# Altium schematic sheet STM8L101F3_PINOUT.SchDoc
size C; SheetNumber: 19; SheetTotal: 19
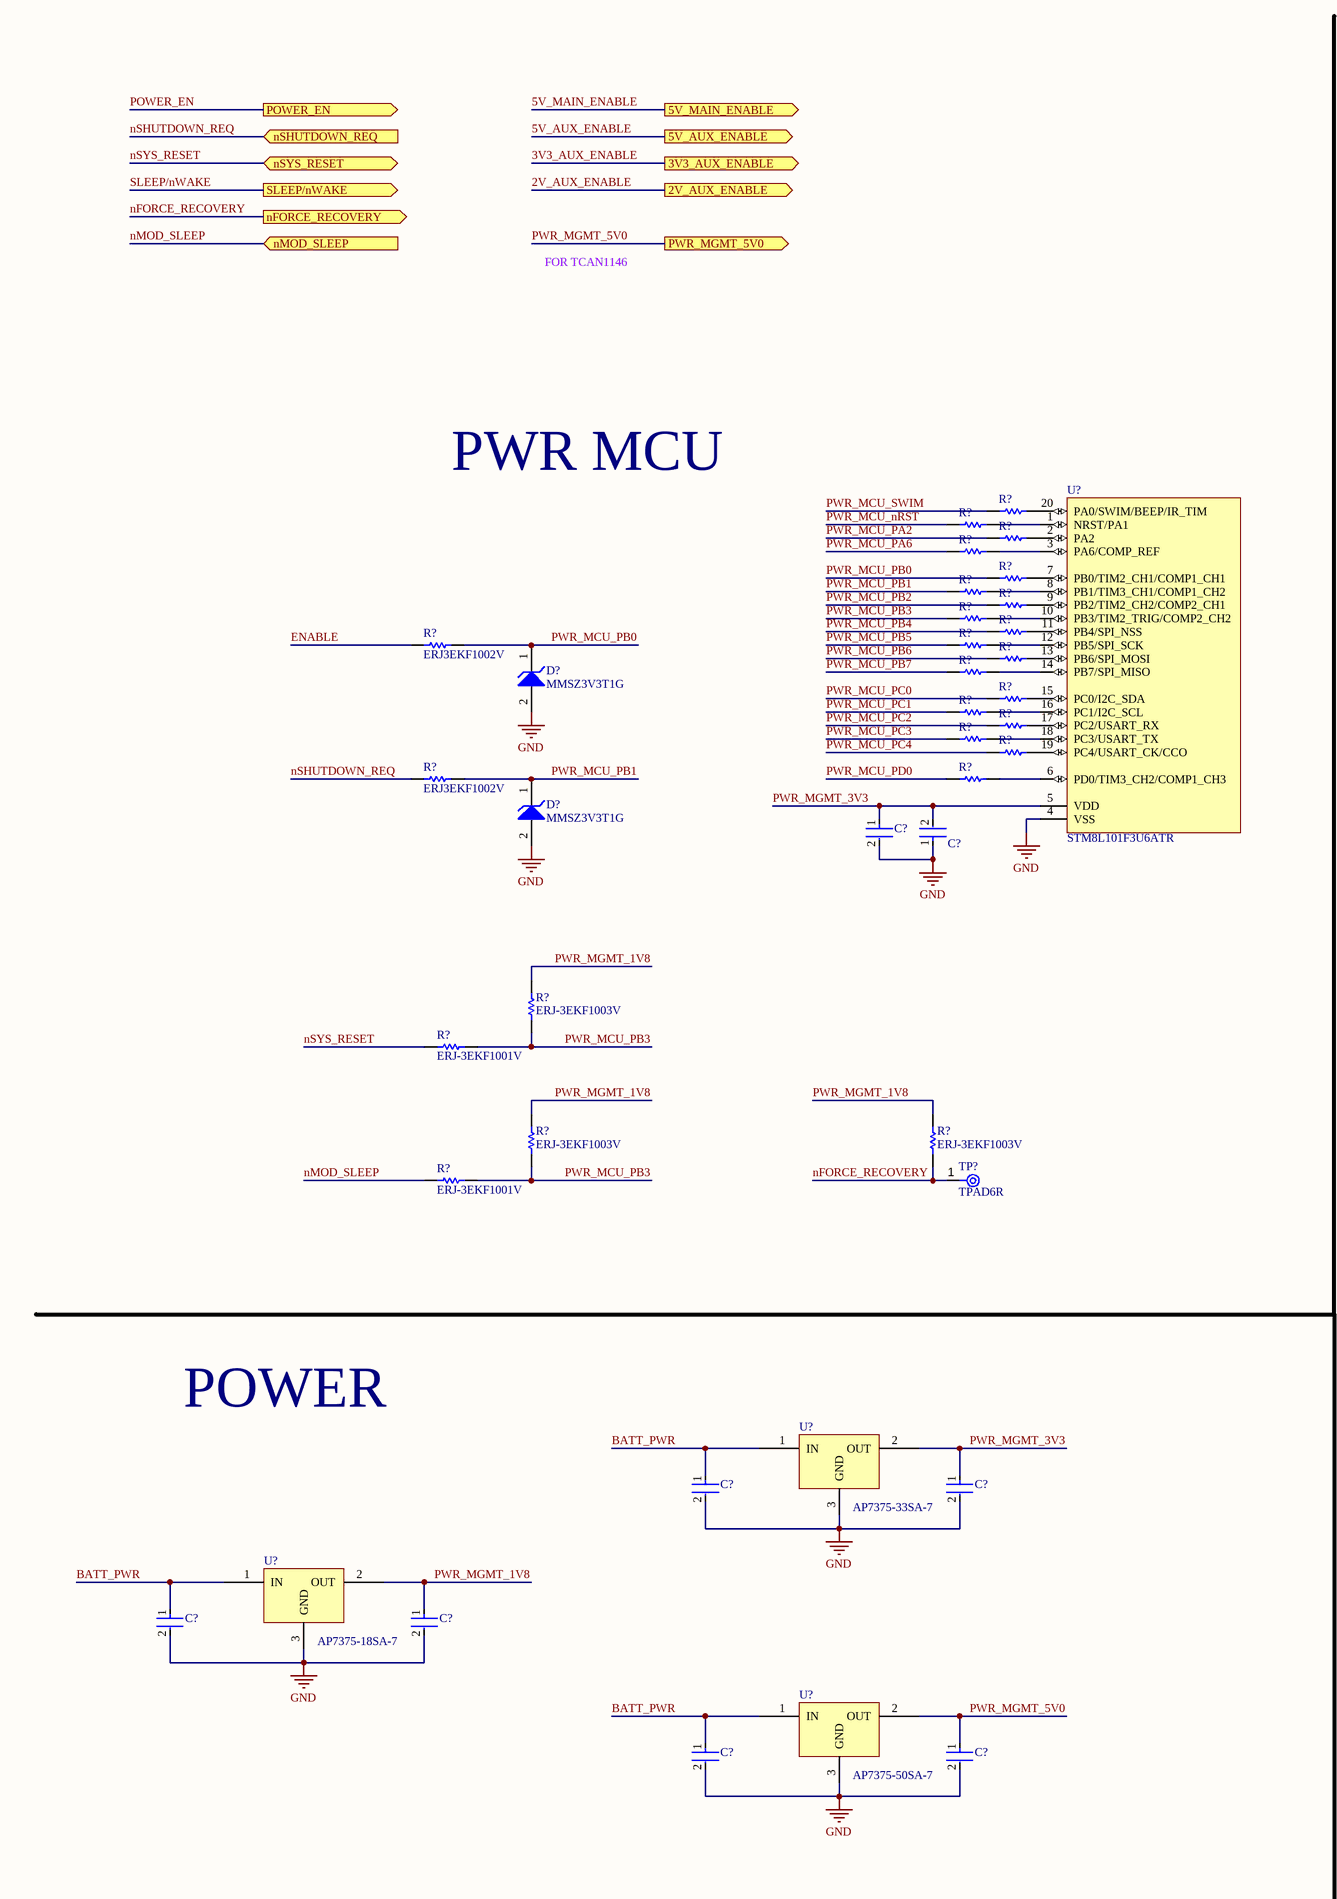
[diagram p0: STM8L101F3_PINOUT.SchDoc, left]
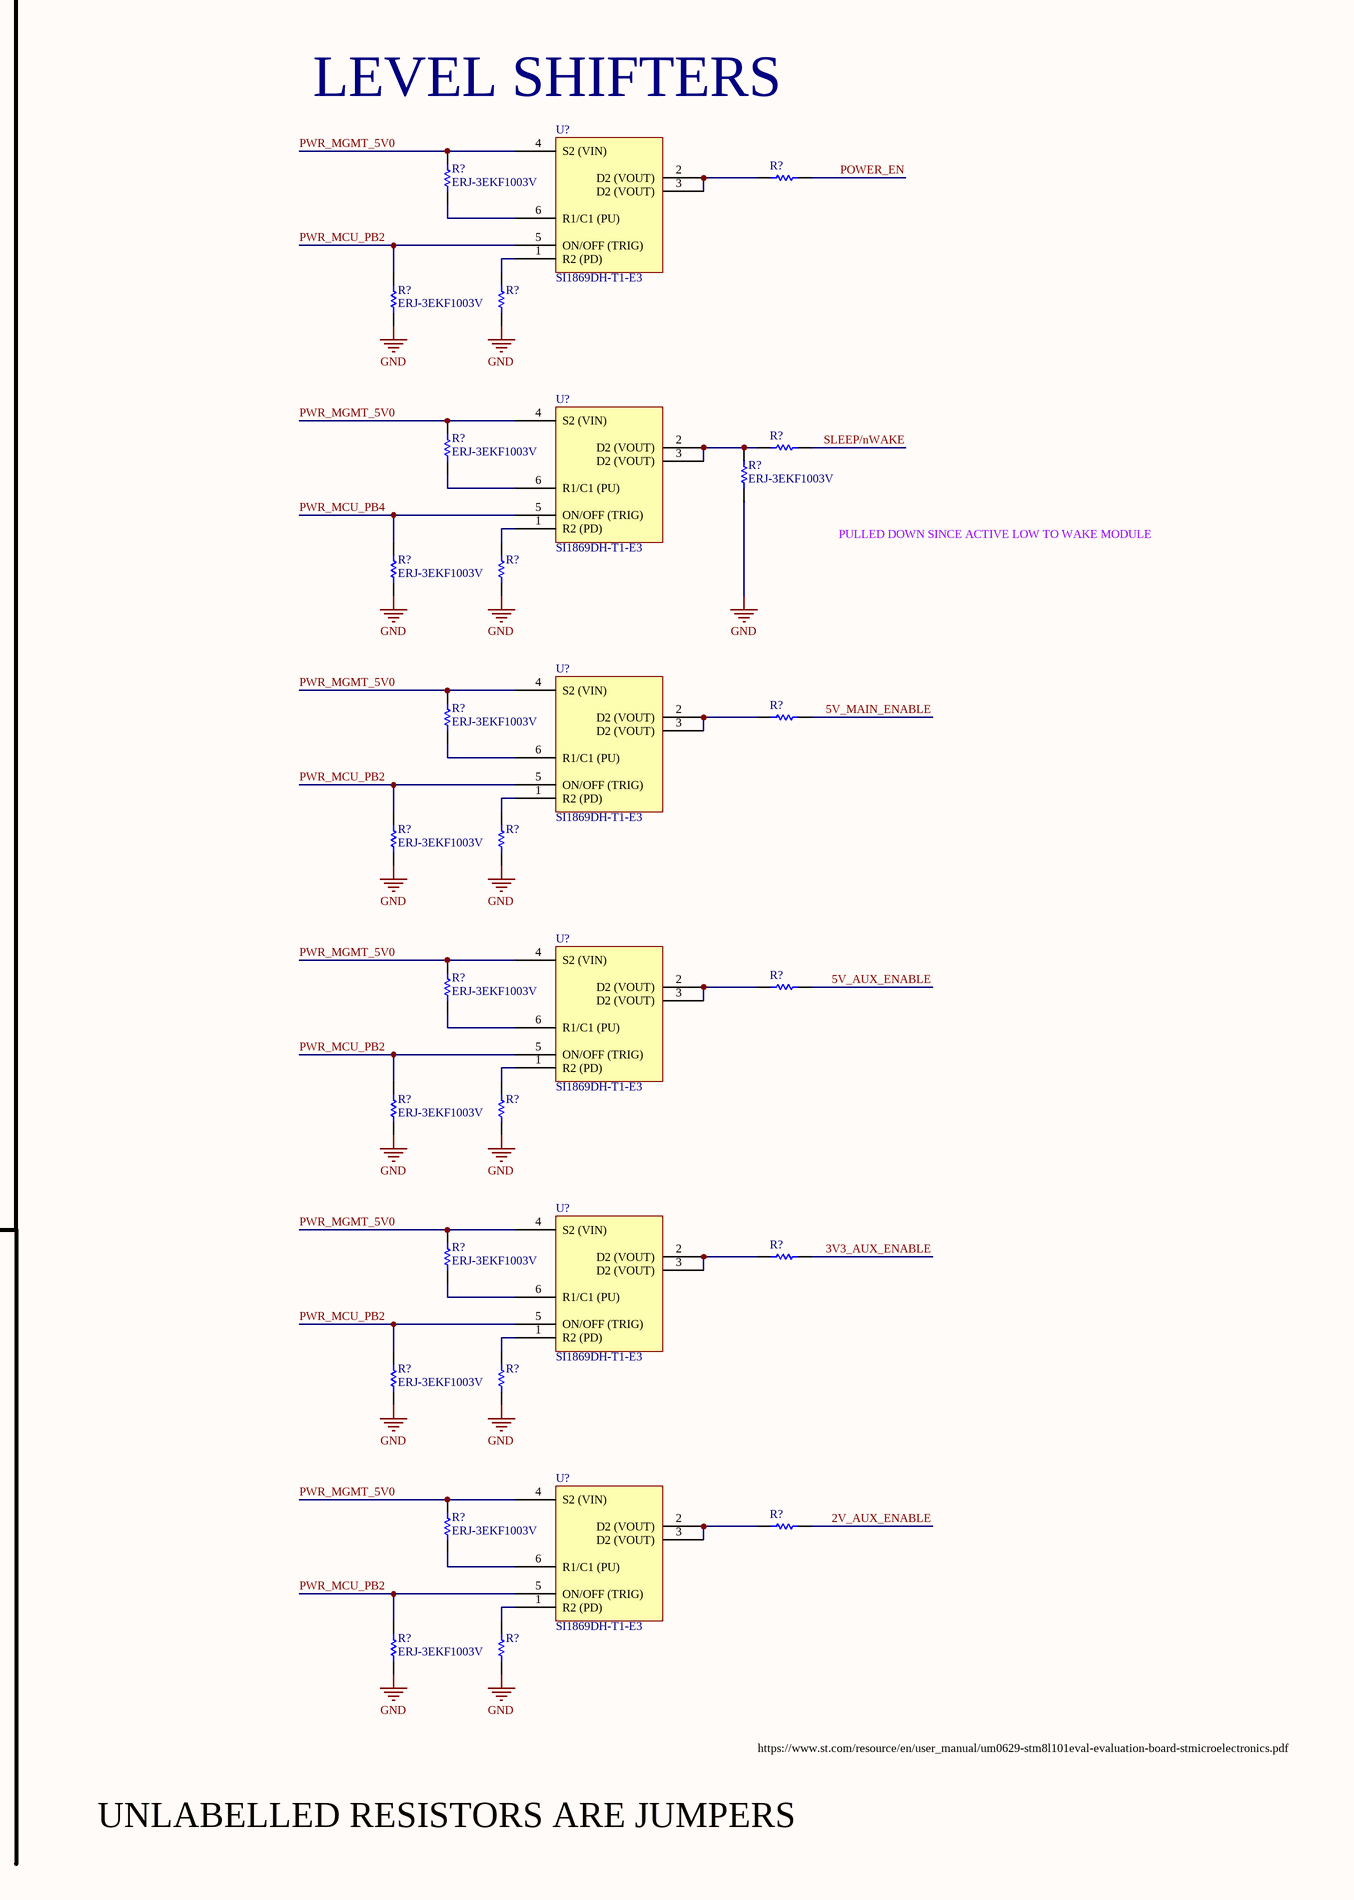
[diagram p1: STM8L101F3_PINOUT.SchDoc, right]

## Parts
(Parts that share a designator on the sheet are numbered #1, #2 ... from top to bottom, then left to right.)
C?#1  CL05A106MP5NUNC  [FP-CL05A106MP5NUNC-MFG]  (value not drawn)
C?#2  C1005X7R1H104K050BB  [FP-C1005-050-0_05-IPC_C]  (value not drawn)
C?#3  GRM188R61E106KA73D  [FP-GRM188-0_2-IPC_A]  (value not drawn)
C?#4  GRM188R61E106KA73D  [FP-GRM188-0_2-IPC_A]  (value not drawn)
C?#5  GRM188R61E106KA73D  [FP-GRM188-0_2-IPC_A]  (value not drawn)
C?#6  GRM188R61E106KA73D  [FP-GRM188-0_2-IPC_A]  (value not drawn)
C?#7  GRM188R61E106KA73D  [FP-GRM188-0_2-IPC_A]  (value not drawn)
C?#8  GRM188R61E106KA73D  [FP-GRM188-0_2-IPC_A]  (value not drawn)
D?#1  MMSZ3V3T1G  [ONSC-SOD-123-2-425-04_V]
D?#2  MMSZ3V3T1G  [ONSC-SOD-123-2-425-04_V]
R?#1  0402 JUMPER  [RESC1005X40X25ML05T05]  (value not drawn)
R?#2  ERJ-3EKF1003V  [RESC1608X55X30ML15T15]
R?#3  0402 JUMPER  [RESC1005X40X25ML05T05]  (value not drawn)
R?#4  ERJ-3EKF1003V  [RESC1608X55X30ML15T15]
R?#5  0402 JUMPER  [RESC1005X40X25ML05T05]  (value not drawn)
R?#6  0402 JUMPER  [RESC1005X40X25ML05T05]  (value not drawn)
R?#7  0402 JUMPER  [RESC1005X40X25ML05T05]  (value not drawn)
R?#8  0402 JUMPER  [RESC1005X40X25ML05T05]  (value not drawn)
R?#9  0402 JUMPER  [RESC1005X40X25ML05T05]  (value not drawn)
R?#10  ERJ-3EKF1003V  [RESC1608X55X30ML15T15]
R?#11  0402 JUMPER  [RESC1005X40X25ML05T05]  (value not drawn)
R?#12  0402 JUMPER  [RESC1005X40X25ML05T05]  (value not drawn)
R?#13  ERJ-3EKF1003V  [RESC1608X55X30ML15T15]
R?#14  0402 JUMPER  [RESC1005X40X25ML05T05]  (value not drawn)
R?#15  0402 JUMPER  [RESC1005X40X25ML05T05]  (value not drawn)
R?#16  0402 JUMPER  [RESC1005X40X25ML05T05]  (value not drawn)
R?#17  0402 JUMPER  [RESC1005X40X25ML05T05]  (value not drawn)
R?#18  ERJ3EKF1002V  [RESC1609X55X30LL15T15]
R?#19  0402 JUMPER  [RESC1005X40X25ML05T05]  (value not drawn)
R?#20  0402 JUMPER  [RESC1005X40X25ML05T05]  (value not drawn)
R?#21  0402 JUMPER  [RESC1005X40X25ML05T05]  (value not drawn)
R?#22  ERJ-3EKF1003V  [RESC1608X55X30ML15T15]
R?#23  0402 JUMPER  [RESC1005X40X25ML05T05]  (value not drawn)
R?#24  0402 JUMPER  [RESC1005X40X25ML05T05]  (value not drawn)
R?#25  0402 JUMPER  [RESC1005X40X25ML05T05]  (value not drawn)
R?#26  0402 JUMPER  [RESC1005X40X25ML05T05]  (value not drawn)
R?#27  0402 JUMPER  [RESC1005X40X25ML05T05]  (value not drawn)
R?#28  0402 JUMPER  [RESC1005X40X25ML05T05]  (value not drawn)
R?#29  ERJ3EKF1002V  [RESC1609X55X30LL15T15]
R?#30  0402 JUMPER  [RESC1005X40X25ML05T05]  (value not drawn)
R?#31  ERJ-3EKF1003V  [RESC1608X55X30ML15T15]
R?#32  0402 JUMPER  [RESC1005X40X25ML05T05]  (value not drawn)
R?#33  ERJ-3EKF1003V  [RESC1608X55X30ML15T15]
R?#34  ERJ-3EKF1003V  [RESC1608X55X30ML15T15]
R?#35  ERJ-3EKF1001V  [RESC1608X55X30LL15T15]
R?#36  0402 JUMPER  [RESC1005X40X25ML05T05]  (value not drawn)
R?#37  ERJ-3EKF1003V  [RESC1608X55X30ML15T15]
R?#38  ERJ-3EKF1003V  [RESC1608X55X30ML15T15]
R?#39  ERJ-3EKF1003V  [RESC1608X55X30ML15T15]
R?#40  ERJ-3EKF1001V  [RESC1608X55X30LL15T15]
R?#41  0402 JUMPER  [RESC1005X40X25ML05T05]  (value not drawn)
R?#42  ERJ-3EKF1003V  [RESC1608X55X30ML15T15]
R?#43  0402 JUMPER  [RESC1005X40X25ML05T05]  (value not drawn)
R?#44  ERJ-3EKF1003V  [RESC1608X55X30ML15T15]
R?#45  0402 JUMPER  [RESC1005X40X25ML05T05]  (value not drawn)
R?#46  ERJ-3EKF1003V  [RESC1608X55X30ML15T15]
R?#47  0402 JUMPER  [RESC1005X40X25ML05T05]  (value not drawn)
R?#48  ERJ-3EKF1003V  [RESC1608X55X30ML15T15]
R?#49  0402 JUMPER  [RESC1005X40X25ML05T05]  (value not drawn)
R?#50  ERJ-3EKF1003V  [RESC1608X55X30ML15T15]
TP?  TPAD6R  [New footprint 1]
U?#1  SI1869DH-T1-E3  [SOT65P242X110-6N]
U?#2  STM8L101F3U6ATR  [UFQFPN20_V]
U?#3  SI1869DH-T1-E3  [SOT65P242X110-6N]
U?#4  SI1869DH-T1-E3  [SOT65P242X110-6N]
U?#5  SI1869DH-T1-E3  [SOT65P242X110-6N]
U?#6  SI1869DH-T1-E3  [SOT65P242X110-6N]
U?#7  AP7375-33SA-7  [SOT90P285X110-3N]
U?#8  SI1869DH-T1-E3  [SOT65P242X110-6N]
U?#9  AP7375-18SA-7  [SOT90P285X110-3N]
U?#10  AP7375-50SA-7  [SOT90P285X110-3N]

## Ports
2V_AUX_ENABLE (out), 3V3_AUX_ENABLE (out), 5V_AUX_ENABLE (out), 5V_MAIN_ENABLE (out), nFORCE_RECOVERY (out), nMOD_SLEEP (in), nSHUTDOWN_REQ (in), nSYS_RESET (bidir), POWER_EN (out), PWR_MGMT_5V0 (out), SLEEP/nWAKE (out)

## Nets
GND: C?#1.2 C?#2.1 C?#3.2 C?#4.2 C?#5.2 C?#6.2 C?#7.2 C?#8.2 D?#1.2(A) D?#2.2(A) R?#3.2 R?#4.1 R?#13.1 R?#20.2 R?#22.1 R?#32.2 R?#33.1 R?#41.2 R?#42.1 R?#45.2 R?#46.1 R?#49.2 R?#50.1 U?#2.4(VSS) U?#7.3(GND) U?#9.3(GND) U?#10.3(GND)
2V_AUX_ENABLE: R?#47.2 ; port 2V_AUX_ENABLE
3V3_AUX_ENABLE: R?#43.2 ; port 3V3_AUX_ENABLE
5V_AUX_ENABLE: R?#36.2 ; port 5V_AUX_ENABLE
5V_MAIN_ENABLE: R?#30.2 ; port 5V_MAIN_ENABLE
BATT_PWR: C?#3.1 C?#5.1 C?#7.1 U?#7.1(IN) U?#9.1(IN) U?#10.1(IN)
ENABLE: R?#18.1
nFORCE_RECOVERY: R?#39.1 TP?.1(TP) ; port nFORCE_RECOVERY
nMOD_SLEEP: R?#40.1 ; port nMOD_SLEEP
nSHUTDOWN_REQ: R?#29.1 ; port nSHUTDOWN_REQ
nSYS_RESET: R?#35.1 ; port nSYS_RESET
POWER_EN: R?#1.2 ; port POWER_EN
PWR_MCU_nRST: R?#6.1
PWR_MCU_PA2: R?#7.1
PWR_MCU_PA6: R?#9.1
PWR_MCU_PB0: D?#1.1(K) R?#11.1 R?#18.2
PWR_MCU_PB1: D?#2.1(K) R?#12.1 R?#29.2
PWR_MCU_PB2: R?#4.2 R?#14.1 R?#33.2 R?#42.2 R?#46.2 R?#50.2 U?#1.5(ON/OFF_(TRIG)) U?#4.5(ON/OFF_(TRIG)) U?#5.5(ON/OFF_(TRIG)) U?#6.5(ON/OFF_(TRIG)) U?#8.5(ON/OFF_(TRIG))
PWR_MCU_PB3: R?#15.1 R?#34.1 R?#35.2 R?#38.1 R?#40.2
PWR_MCU_PB4: R?#16.1 R?#22.2 U?#3.5(ON/OFF_(TRIG))
PWR_MCU_PB5: R?#17.1
PWR_MCU_PB6: R?#19.1
PWR_MCU_PB7: R?#21.1
PWR_MCU_PC0: R?#23.1
PWR_MCU_PC1: R?#24.1
PWR_MCU_PC2: R?#25.1
PWR_MCU_PC3: R?#26.1
PWR_MCU_PC4: R?#27.1
PWR_MCU_PD0: R?#28.1
PWR_MCU_SWIM: R?#5.1
PWR_MGMT_1V8: C?#6.1 R?#34.2 R?#38.2 R?#39.2 U?#9.2(OUT)
PWR_MGMT_3V3: C?#1.1 C?#2.2 C?#4.1 U?#2.5(VDD) U?#7.2(OUT)
PWR_MGMT_5V0: C?#8.1 R?#2.2 R?#10.2 R?#31.2 R?#37.2 R?#44.2 R?#48.2 U?#1.4(S2_(VIN)) U?#3.4(S2_(VIN)) U?#4.4(S2_(VIN)) U?#5.4(S2_(VIN)) U?#6.4(S2_(VIN)) U?#8.4(S2_(VIN)) U?#10.2(OUT) ; port PWR_MGMT_5V0
SLEEP/nWAKE: R?#8.2 ; port SLEEP/nWAKE
NetR?#1_1: R?#1.1 U?#1.2(D2_(VOUT)) U?#1.3(D2_(VOUT))
NetR?#2_1: R?#2.1 U?#1.6(R1/C1_(PU))
NetR?#3_1: R?#3.1 U?#1.1(R2_(PD))
NetR?#5_2: R?#5.2 U?#2.20(PA0/SWIM/BEEP/IR_TIM)
NetR?#6_2: R?#6.2 U?#2.1(NRST/PA1)
NetR?#7_2: R?#7.2 U?#2.2(PA2)
NetR?#8_1: R?#8.1 R?#13.2 U?#3.2(D2_(VOUT)) U?#3.3(D2_(VOUT))
NetR?#9_2: R?#9.2 U?#2.3(PA6/COMP_REF)
NetR?#10_1: R?#10.1 U?#3.6(R1/C1_(PU))
NetR?#11_2: R?#11.2 U?#2.7(PB0/TIM2_CH1/COMP1_CH1)
NetR?#12_2: R?#12.2 U?#2.8(PB1/TIM3_CH1/COMP1_CH2)
NetR?#14_2: R?#14.2 U?#2.9(PB2/TIM2_CH2/COMP2_CH1)
NetR?#15_2: R?#15.2 U?#2.10(PB3/TIM2_TRIG/COMP2_CH2)
NetR?#16_2: R?#16.2 U?#2.11(PB4/SPI_NSS)
NetR?#17_2: R?#17.2 U?#2.12(PB5/SPI_SCK)
NetR?#19_2: R?#19.2 U?#2.13(PB6/SPI_MOSI)
NetR?#20_1: R?#20.1 U?#3.1(R2_(PD))
NetR?#21_2: R?#21.2 U?#2.14(PB7/SPI_MISO)
NetR?#23_2: R?#23.2 U?#2.15(PC0/I2C_SDA)
NetR?#24_2: R?#24.2 U?#2.16(PC1/I2C_SCL)
NetR?#25_2: R?#25.2 U?#2.17(PC2/USART_RX)
NetR?#26_2: R?#26.2 U?#2.18(PC3/USART_TX)
NetR?#27_2: R?#27.2 U?#2.19(PC4/USART_CK/CCO)
NetR?#28_2: R?#28.2 U?#2.6(PD0/TIM3_CH2/COMP1_CH3)
NetR?#30_1: R?#30.1 U?#4.2(D2_(VOUT)) U?#4.3(D2_(VOUT))
NetR?#31_1: R?#31.1 U?#4.6(R1/C1_(PU))
NetR?#32_1: R?#32.1 U?#4.1(R2_(PD))
NetR?#36_1: R?#36.1 U?#5.2(D2_(VOUT)) U?#5.3(D2_(VOUT))
NetR?#37_1: R?#37.1 U?#5.6(R1/C1_(PU))
NetR?#41_1: R?#41.1 U?#5.1(R2_(PD))
NetR?#43_1: R?#43.1 U?#6.2(D2_(VOUT)) U?#6.3(D2_(VOUT))
NetR?#44_1: R?#44.1 U?#6.6(R1/C1_(PU))
NetR?#45_1: R?#45.1 U?#6.1(R2_(PD))
NetR?#47_1: R?#47.1 U?#8.2(D2_(VOUT)) U?#8.3(D2_(VOUT))
NetR?#48_1: R?#48.1 U?#8.6(R1/C1_(PU))
NetR?#49_1: R?#49.1 U?#8.1(R2_(PD))

## Notes on the sheet
- LEVEL SHIFTERS
- FOR TCAN1146
- PWR MCU
- PULLED DOWN SINCE ACTIVE LOW TO WAKE MODULE
- POWER
- https://www.st.com/resource/en/user_manual/um0629-stm8l101eval-evaluation-board-stmicroelectronics.pdf
- UNLABELLED RESISTORS ARE JUMPERS

## Library data of the parts
C?#1 = CMP-13271-000002-1: CAP CER 10UF 10V X5R 0402; Manufacturer: Samsung; Temperature Coefficient: 15%; Tolerance: 20%; Material: Ceramic; Octopart: https://octopart.com/cl05a106mp5nunc-samsung-22457395; Voltage Rating: 10V; RoHS: TRUE; Value: 10uF; Height: 0.7mm; Digikey Description: CAP CER 10UF 10V X5R 0402; Automotive: No; Package: CL05A106MP5NUNC; Device Class L1: Passive Components; Capacitance: 10uF; Temperature Range High: +85°C; ComponentLink2Description: Datasheet; Device Class L2: Capacitors; Temperature Characteristic: X5R; Manufacturer Part Number: CL05A106MP5NUNC; Temperature: -55°C to +85°C; ComponentLink2URL: http://www.samsungsem.com/kr/support/product-search/mlcc/__icsFiles/afieldfile/2019/05/10/19-CL05A106MP5NUNC.pdf; Device Class L3: Ceramic Capacitors; Category: Cap; Temperature Range Low: -55°C; Ipc Land Pattern Name: CAPC10050X50; Lead Free: Yes
C?#2 = CMP-2000-05393-2: Multilayer Ceramic Capacitors 100nF ±10% 50V X7R SMD 0402; Voltage: 50V; Dielectric Material: Ceramic; Min Operating Temperature: -55°C; Depth: 0.5mm; Radiation Hardening: No; RoHS Compliant: Yes; Voltage Rating (DC): 50V; Lead Free: Lead Free; Resistor Type: Ceramic; Height: 0.5mm; Dielectric: X7R; Thickness: 0.022inch; Case/Package: 0402; Case Code (Metric): 1005; Termination: SMD/SMT; Capacitance: 100nF; Packaging: Tape and Reel; Max Operating Temperature: 125°C; Mount: Surface Mount; Package Quantity: 1; Width: 0.02inch; Weight: 2.3E-05oz; Voltage Rating: 50V; Tolerance: 10%; Construction: Flat; Case Code (Imperial): 0402; Length: 1mm; REACH SVHC: No SVHC; Series: C
C?#3-C?#8 = CMP-06035-045268-1: Chip Multilayer Ceramic Capacitors for General Purpose, 0603, 10uF, X5R, 15%, 10%, 25V; Case/Package: 0603
D?#1 D?#2 = CMP-1060-00515-1: Zener Voltage Regulator, 500 mW, 2-Pin SOD-123, Pb-Free, Tape and Reel; Manufacturer: On Semiconductor; P Max (W): 0.5; ComponentLink3URL: http://www.onsemi.com/pub_link/Collateral/425-04.PDF; ComponentLink2Description: Datasheet; DatasheetVersion: Rev. 11; ComponentLink1URL: http://www.onsemi.com/; PackageDescription: 2-Pin SOD, Body 1.6 x 2.69 mm; Mounting Technology: Surface Mount; ComponentLink3Description: Package Specification; ComponentLink1Description: Manufacturer URL; Packing: Tape and Reel; ComponentLink2URL: http://www.onsemi.com/pub_link/Collateral/MMSZ2V4T1-D.PDF; PartNumber: MMSZ3V3T1G; PackageReference: SOD-123-2-425-04; PackageVersion: Rev. G, 10/2009; RoHS: Pb-Free
R?#1 R?#3 R?#5-R?#9 R?#11 R?#12 R?#14-R?#17 R?#19-R?#21 R?#23-R?#28 R?#30 R?#32 R?#36 R?#41 R?#43 R?#45 R?#47 R?#49 = CMP-009-00118-2: READ THE NAME; Pins: 2; Component Type: Standard; Design Item ID: CMP-009-00206-2; Source: 0402jump.SchLib
R?#2 R?#4 R?#10 R?#13 R?#22 R?#31 R?#33 R?#34 R?#37-R?#39 R?#42 R?#44 R?#46 R?#48 R?#50 = CMP-2000-00182-1: Manufacturer: Panasonic; Part Number: ERJ-3EKF1003V
R?#18 R?#29 = CMP-1012-00623-3: Chip Resistor, 10 KOhm, +/- 1%, 0.1 W, -55 to 155 degC, 0603 (1608 Metric), RoHS, Tape and Reel; Manufacturer: Panasonic; Voltage Rating: 75V; Case\/Package: 0603; Power Rating: 100mW; Resistance: 10KOhm; Temperature Coefficient: 100ppm\/degreesC; Number of Pins: 2; Package Reference: 603; Depth: 0.8mm; Mount: SurfaceMount; Package Description: 2-Pin Surface Mount Device, Body 1.6 x 0.85 mm; Datasheet Version: 02/2017; Length: 1.6mm; Lead Free: LeadFree; Height: 0.45mm; Number of Terminations: 2; Max Power Dissipation: 100mW; Min Operating Temperature: -55degC; Datasheet URL: https://industrial.panasonic.com/cdbs/www-data/pdf/RDA0000/AOA0000C304.pdf; Termination: SMD/SMT; Case Code (Metric): 1608; Case Code (Imperial): 0603; Tolerance: 1%; Max Operating Temperature: 155degC; RoHSCompliant: true; Voltage Rating (DC): 75V; Radiation Hardening: No; Packaging: TapeandReel; Composition: ThickFilm; Mounting Technology: SurfaceMount; Manufacturer URL: http://www.panasonic.com/; Width: 0.031inch; REACH SVHC: NoSVHC; Contact Plating: Tin; Military Standard: Not; Package Quantity: 1
R?#35 R?#40 = CMP-2000-00180-1: Manufacturer: Panasonic; Part Number: ERJ-3EKF1001V
TP? = CMP-00025-2: Test Point .6mm
U?#1 U?#3-U?#6 U?#8 = CMP-019-00043-2: Power Supply Support Circuit, Adjustable, 1 Channel, PDSO6; Max Supply Voltage: 20V; Min Supply Voltage: 1.8V; Case/Package: TSSOP; Pins: 6; RoHS Compliant: Yes
U?#2 = CMP-0235-00019-1: STM8L ARM-based EnergyLite 8-bit MCU, 8 kB Flash, 1.5 kB Internal RAM, -40 to +85°C Temperature, 20-pin UFQFPN, Tape and Reel, COMP_REF available; ComponentLink3URL: http://www.st.com/internet/com/home/home.jsp; ComponentLink3Description: st.com Home; ComponentLink2URL: http://www.st.com/internet/mcu/subclass/1381.jsp; PackageVersion: 2010; PackageDescription: 20-Pin Ultra Thin Fine Pitch Quad Flat No-Lead, 3 x 3 x 0.55 mm Body, 0.5 mm Pitch; ComponentLink2Description: STM8L Family Web Page; PackageReference: UFQFPN20; ComponentLink1Description: STM8L101 Datasheet; ComponentLink1URL: http://www.st.com/internet/com/TECHNICAL_RESOURCES/TECHNICAL_LITERATURE/DATASHEET/CD00220591.pdf
U?#7 = CMP-019-00039-1: LDO Regulator Pos 3.3V 0.3A 3-Pin SOT-23 T/R
U?#9 = CMP-019-00039-1: MODIFIED COMMENT, 1V8 REG
U?#10 = CMP-019-00039-1: MODIFIED COMMENT, 5V0 REG